# EAGLE design EEPROM shield (EAGLE 6.5.0)
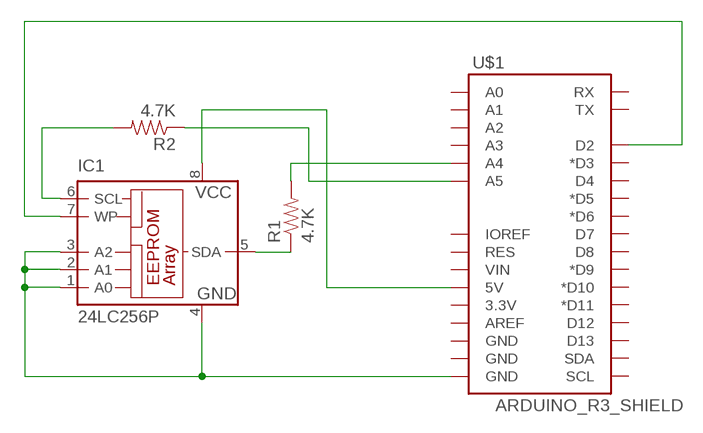
[diagram p0: schematic, sheet 1]

## Parts
IC1  24LC256P  [DIL8]
R1  4.7K  RESISTORPTH-1/4W  [AXIAL-0.4]
R2  4.7K  RESISTORPTH-1/4W  [AXIAL-0.4]
U$1  ARDUINO_R3_SHIELD  [UNO_R3_SHIELD]

## Nets
N$1: IC1.7(WP) U$1.D2
N$2: IC1.1(A0) IC1.2(A1) IC1.3(A2) IC1.4(GND) U$1.GND@0(GND)
N$3: R1.P$2 U$1.A4
N$4: R2.P$1 U$1.A5
N$5: IC1.8(VCC) U$1.5V
N$6: IC1.6(SCL) R2.P$2
N$7: IC1.5(SDA) R1.P$1
Unconnected: U$1.3.3V U$1.A0 U$1.A1 U$1.A2 U$1.A3 U$1.AREF U$1.D3(*D3) U$1.D4 U$1.D5(*D5) U$1.D6(*D6) U$1.D7 U$1.D8 U$1.D9(*D9) U$1.D10(*D10) U$1.D11(*D11) U$1.D12 U$1.D13 U$1.GND@1(GND) U$1.GND@2(GND) U$1.IOREF U$1.RES U$1.RX U$1.SCL U$1.SDA U$1.TX U$1.VIN

## Library data of the parts
IC1 = microchip:24*: Serial EEPROM I2C; MF: MICROCHIP; MPN: 24LC256-E/P; OC_FARNELL: 9757970; OC_NEWARK: 92C7169
R1 R2 = SparkFun-Passives:RESISTOR: Resistor Basic schematic elements and footprints for 0603, 1206, and PTH resistors.
U$1 = SparkFun-Boards:ARDUINO_R3_SHIELD: Shield form compatible with the Arduino Uno R3.

## Board
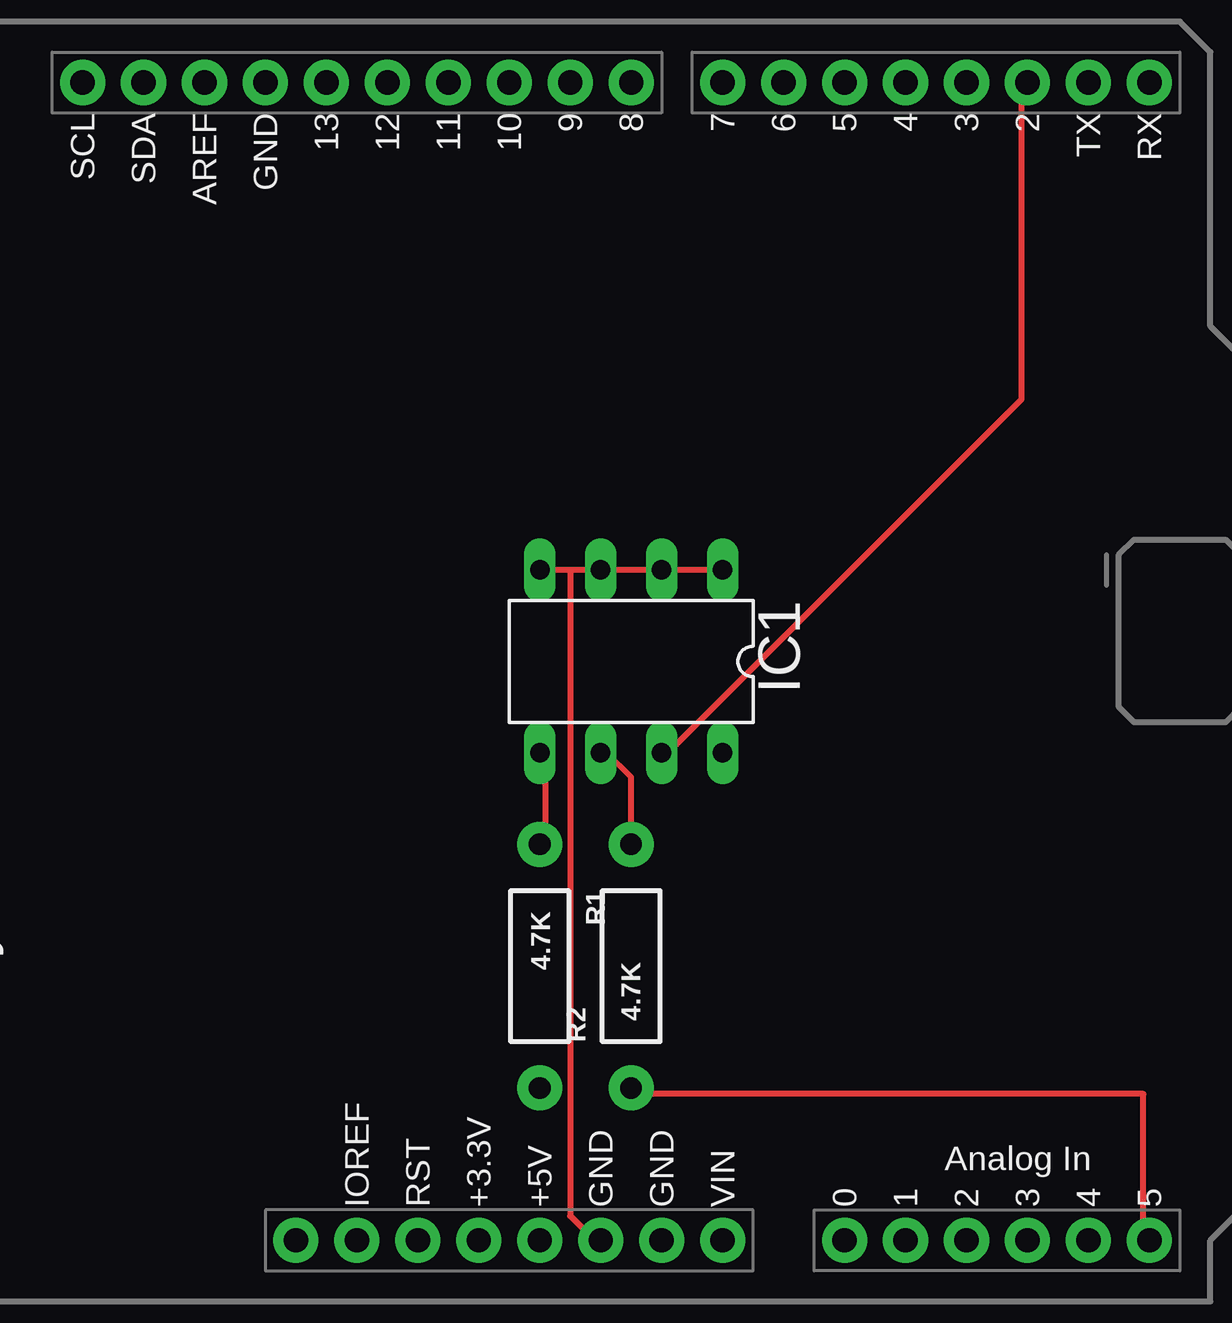
[diagram p1: board, top side]
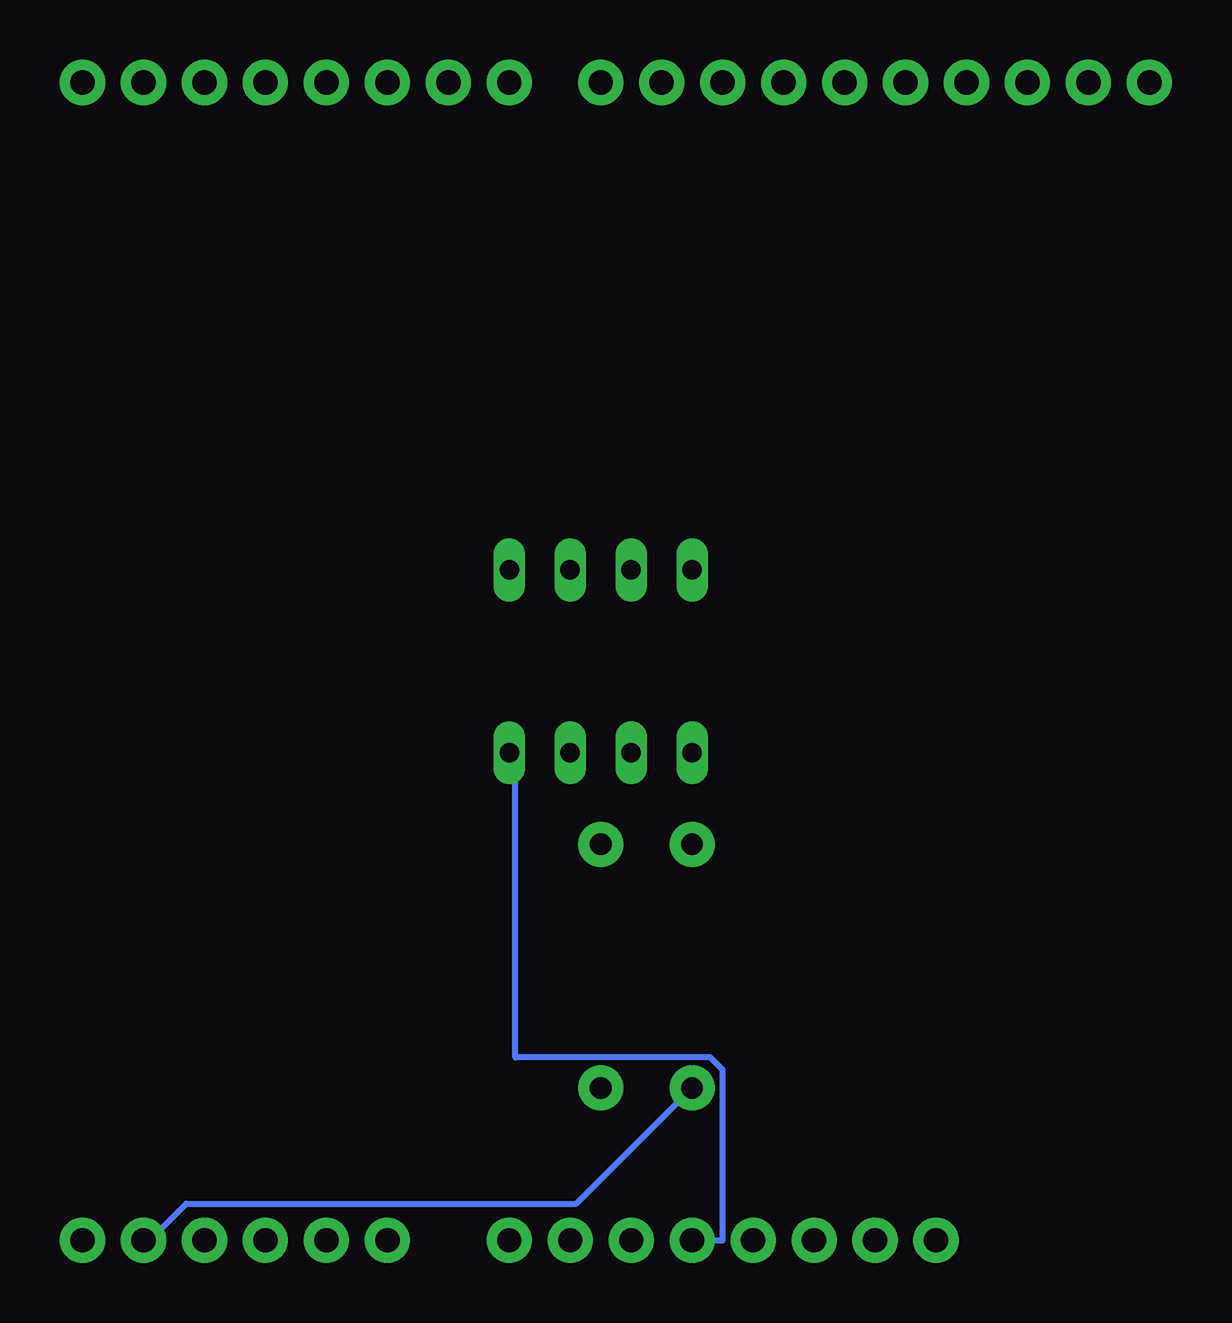
[diagram p2: board, bottom side, seen from below]

No outline drawn. Coordinates in mm, seen from the top.
Copper layers (1*16): Top 0.035mm / dielectric 1.5mm / Bottom 0.035mm
Design rules "default": minimum track width 10mil, minimum drill 24mil, track to track 8mil, track to pad 8mil, pad to pad 8mil, via to via 8mil, smd to smd 8mil, copper to edge 40mil, drill to drill 8mil, minimum pad ring 10mil, minimum via ring 8mil, stop-mask expansion 4mil, vias tented up to drill 0mil, thermal gap 10mil

### Footprints (pad centres in the part's own frame; a part is rotated, then mirrored left to right if it is on the bottom)
DIL8 = drill 0.813 long: 1 -3.81,-3.81; 2 -1.27,-3.81; 3 1.27,-3.81; 4 3.81,-3.81; 5 3.81,3.81; 6 1.27,3.81; 7 -1.27,3.81; 8 -3.81,3.81
AXIAL-0.4 = drill 0.9 pad 1.88: P$1 -5.08,0; P$2 5.08,0
UNO_R3_SHIELD = drill 1.016 pad 1.88: 3.3V 50.8,26.67; 5V 50.8,29.21; A0 50.8,41.91; A1 50.8,44.45; A2 50.8,46.99; A3 50.8,49.53; A4 50.8,52.07; A5 50.8,54.61; AREF 2.54,15.24; D2 2.54,49.53; D3 2.54,46.99; D4 2.54,44.45; D5 2.54,41.91; D6 2.54,39.37; D7 2.54,36.83; D8 2.54,33.02; D9 2.54,30.48; D10 2.54,27.94; D11 2.54,25.4; D12 2.54,22.86; D13 2.54,20.32; GND@0 50.8,31.75; GND@1 50.8,34.29; GND@2 2.54,17.78; IOREF 50.8,21.59; NC 50.8,19.05; RES 50.8,24.13; RX 2.54,54.61; SCL 2.54,10.16; SDA 2.54,12.7; TX 2.54,52.07; VIN 50.8,36.83

### Placement (x,y rotation side)
IC1  33.02,26.67 180 top
R1  29.21,13.97 270 top
R2  33.02,13.97 90 top
U$1  0,53.34 270 top

### Tracks (layer width: path | path; a pad name or v marks a point on that pad's centre or on a via)
N$1
  Top 0.254: IC1.7 34.54,22.86 49.28,37.59 49.28,50.8 U$1.D2
N$2
  Top 0.254: 30.48,30.48 IC1.3 IC1.2 IC1.1 | 30.48,30.48 IC1.4 | 30.48,30.48 30.48,3.56 31.5,2.54 U$1.GND@0
N$3
  Bottom 0.254: R1.P$2 34.04,4.06 50.29,4.06 51.82,2.54 U$1.A4
N$4
  Top 0.254: R2.P$1 33.02,8.64 54.36,8.64 54.36,2.54 U$1.A5
N$5
  Bottom 0.254: U$1.5V 27.94,2.54 27.94,9.65 28.45,10.16 36.58,10.16 36.58,22.86 IC1.8
N$6
  Top 0.254: R2.P$2 33.02,21.84 32,22.86 IC1.6
N$7
  Top 0.254: IC1.5 29.46,22.86 29.46,19.3 R1.P$1

### Text on the board
tPlace: EEPROM Shield | Kyle Isom